# Altium schematic sheet Sheet1.SchDoc
size A2
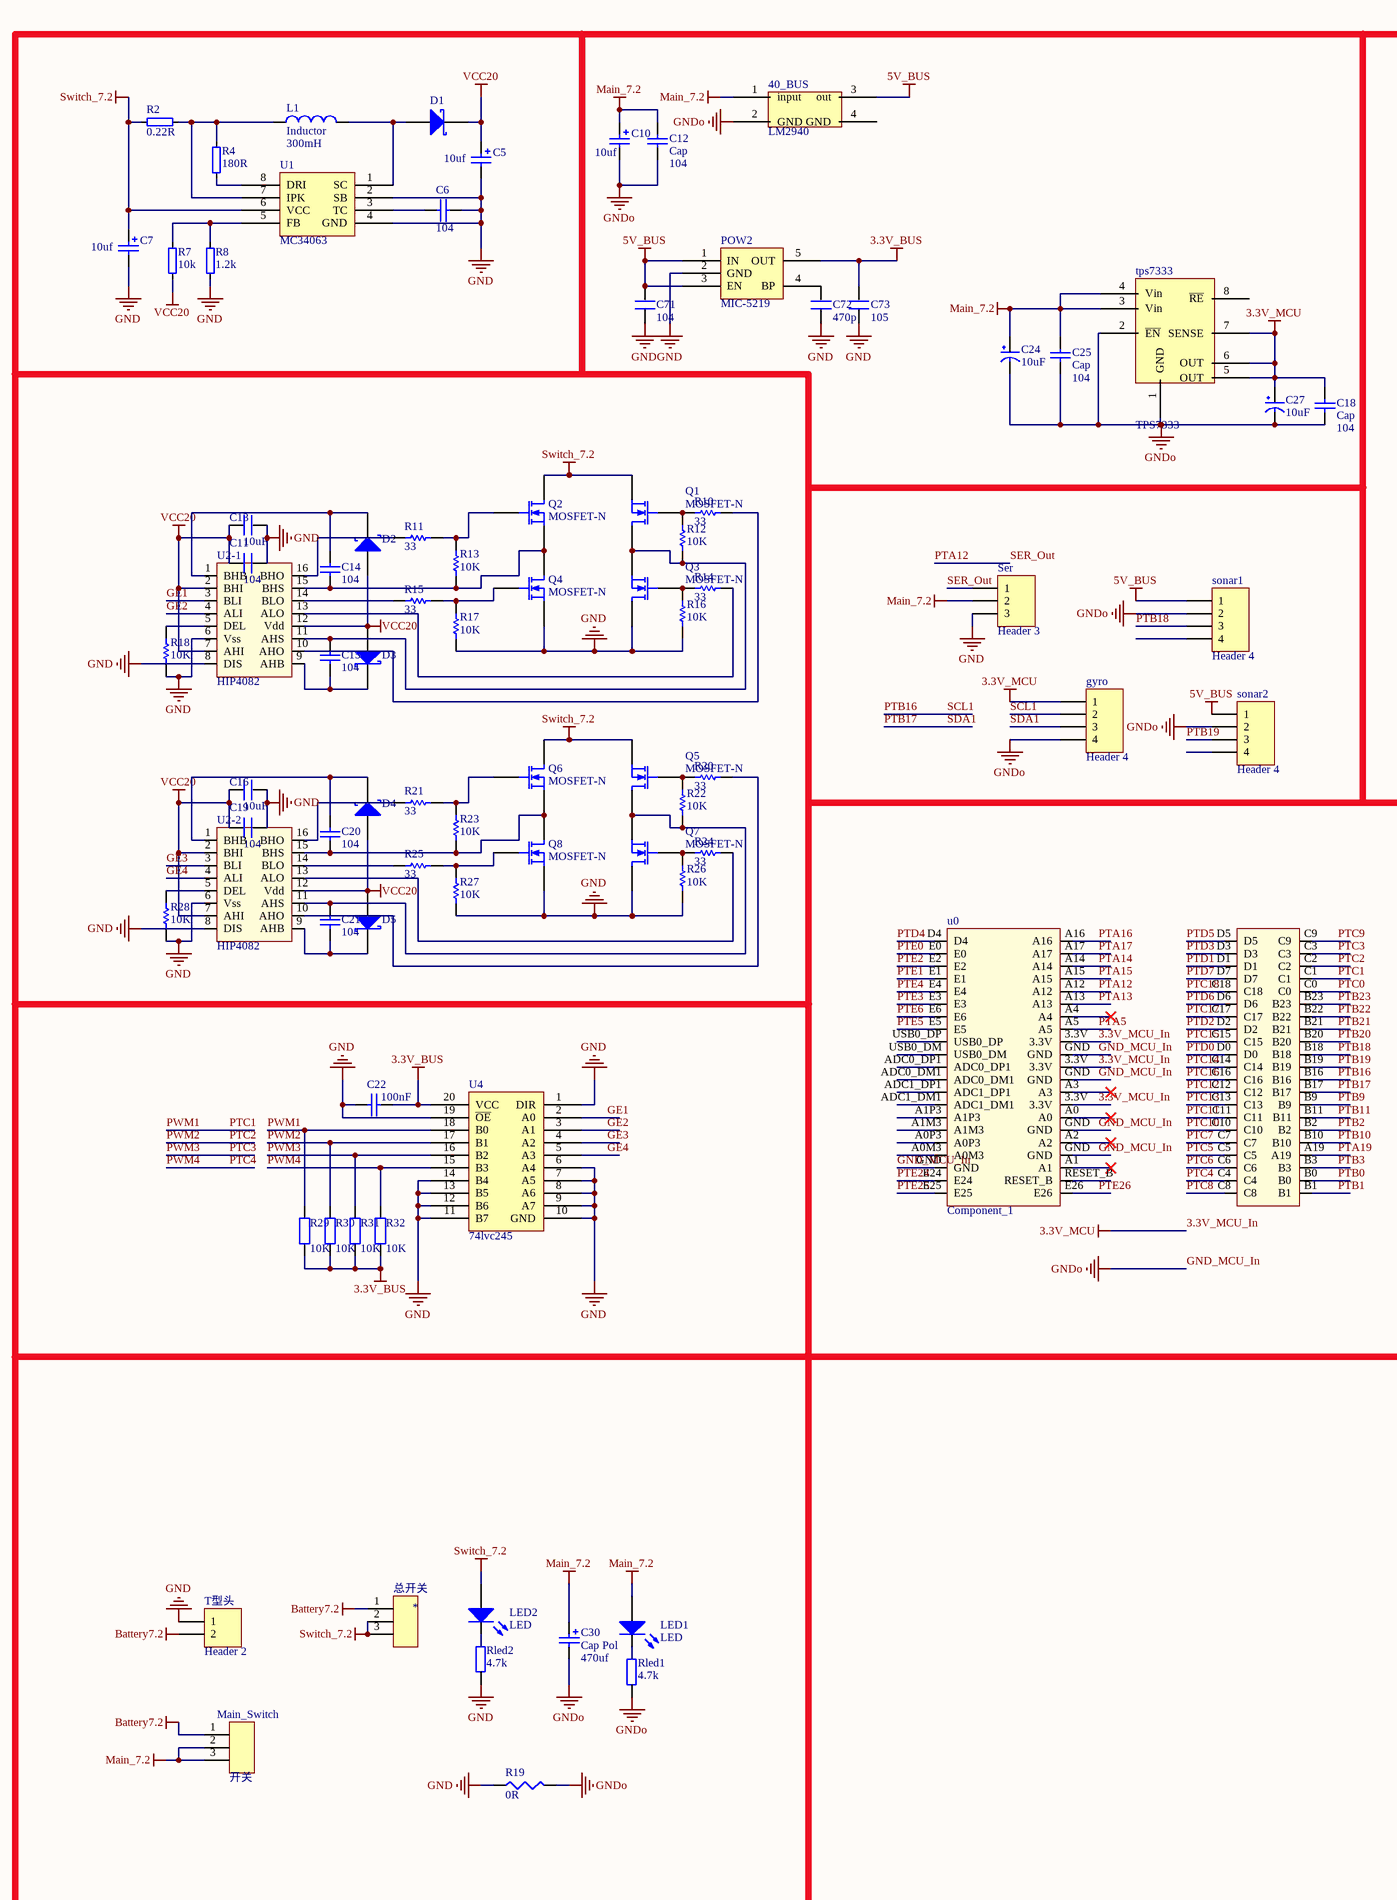
[diagram p0: Sheet1.SchDoc, left]
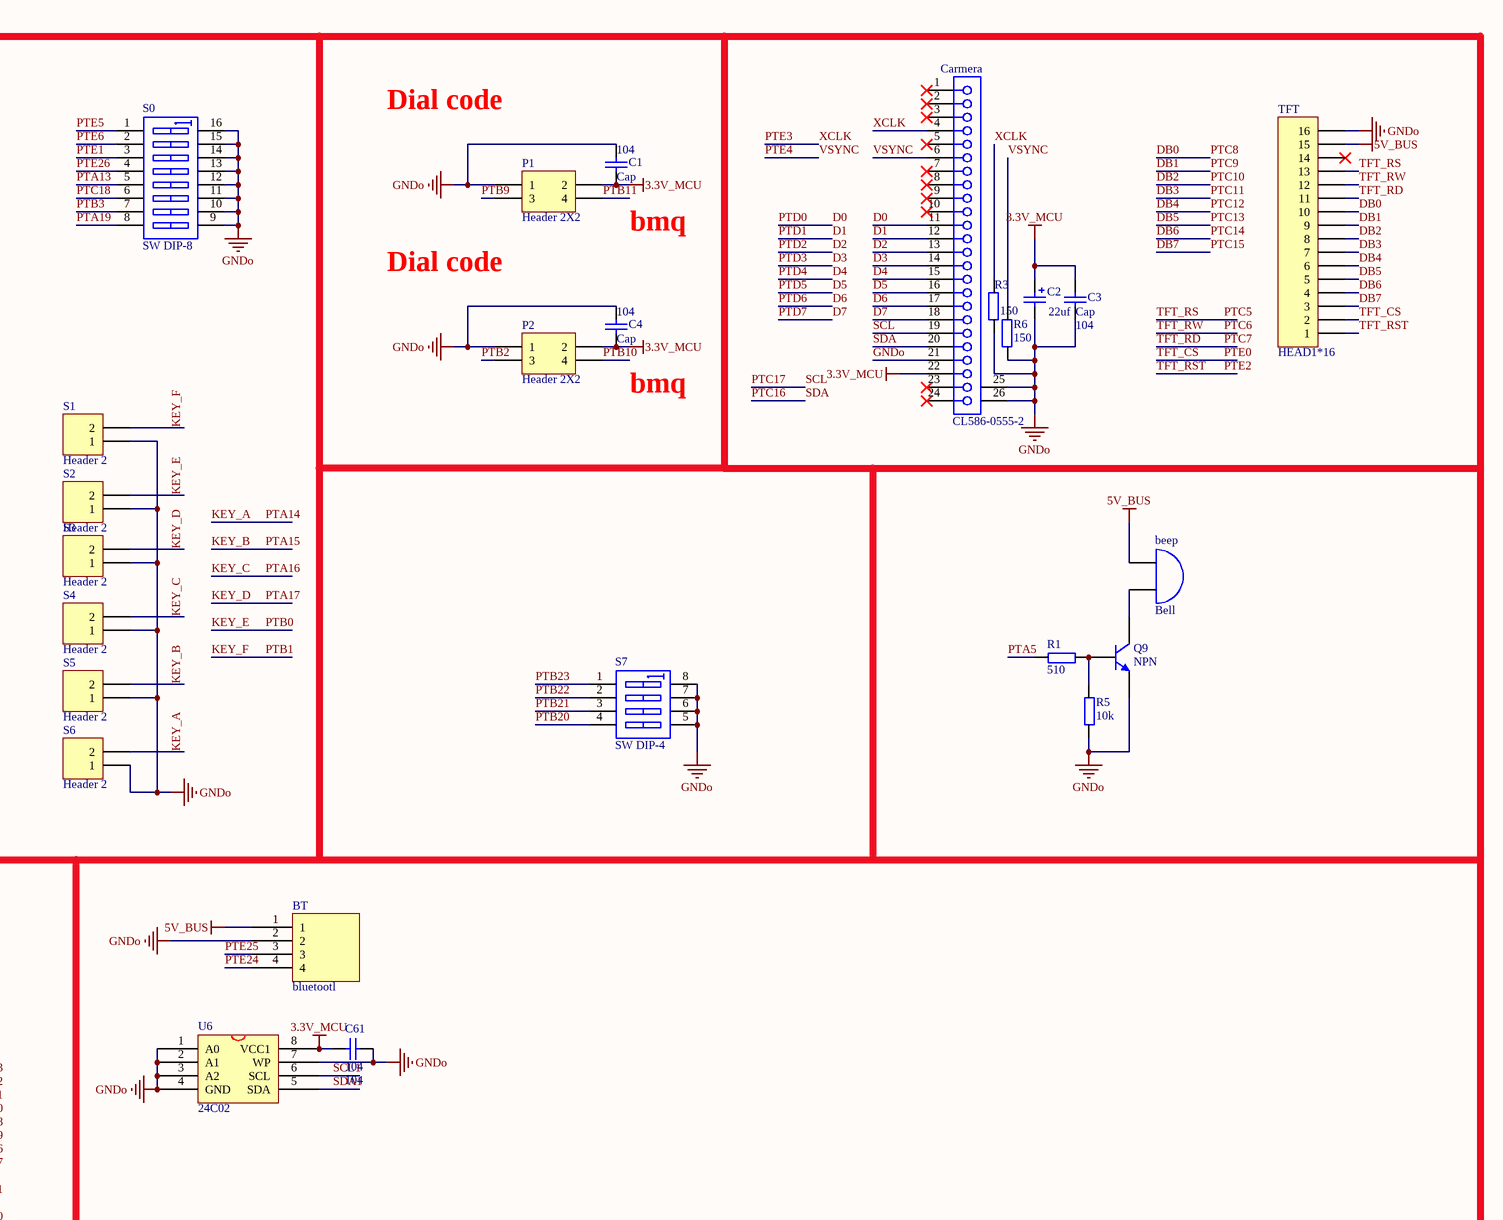
[diagram p1: Sheet1.SchDoc, right]

## Parts
40_BUS  LM2940  [TO-263-3]
beep  Bell  [bell]
BT  bluetootl  [HDR1X4]
C1  Cap  value 104  [0805-0C]
C2  value 22uf  [3216-A-TA]
C3  Cap  value 104  [0805-0C]
C4  Cap  value 104  [0805-0C]
C5  value 10uf  [3216-A-TA]
C6  104  [0805-0C]
C7  value 10uf  [3216-A-TA]
C10  value 10uf  [3216-A-TA]
C11  104  [0805-0C]
C12  Cap  value 104  [0805-0C]
C13  10uF  [3216-A-TA]
C14  value 104  [0805-0C]  (hidden comment: Cap)
C15  value 104  [0805-0C]  (hidden comment: Cap)
C16  10uF  [3216-A-TA]
C18  Cap  value 104  [0805-0C]
C19  104  [0805-0C]
C20  value 104  [0805-0C]  (hidden comment: Cap)
C21  value 104  [0805-0C]  (hidden comment: Cap)
C22  100nF  [0603C]
C24  10uF  [3216-A-TA]
C25  Cap  value 104  [0805-0C]
C27  10uF  [3216-A-TA]
C30  Cap Pol  value 470uf  [C7343]
C61  104  [0603C]
C71  104  [0603P]
C72  470p  [0603P]
C73  105  [0603P]
Carmera  CL586-0555-2  [FH12A-24S-0.5SH]
D1  D Schottky  [DO-214]  (value not drawn)
D2  D Schottky  [DO-214]  (value not drawn)
D3  D Schottky  [DO-214]  (value not drawn)
D4  D Schottky  [DO-214]  (value not drawn)
D5  D Schottky  [DO-214]  (value not drawn)
gyro  Header 4  [HDR1X4]
L1  Inductor  value 300mH  [L7X7]
LED1  LED  [0805LED2]
LED2  LED  [0805LED2]
Main_Switch  开关  [乒乓开关5mm]
P1  Header 2X2  [HDR2X2]
P2  Header 2X2  [HDR2X2]
POW2  MIC-5219  [sot23-5]
Q1  MOSFET-N  [to252]
Q2  MOSFET-N  [to252]
Q3  MOSFET-N  [to252]
Q4  MOSFET-N  [to252]
Q5  MOSFET-N  [to252]
Q6  MOSFET-N  [to252]
Q7  MOSFET-N  [to252]
Q8  MOSFET-N  [to252]
Q9  NPN  [TO-226-AA]
R1  510  [0805-0R]
R2  0.22R  [0805-0R]
R3  150  [0805-0R]
R4  180R  [0805-0R]
R5  10k  [0805-0r]
R6  150  [0805-0R]
R7  10k  [0805-0R]
R8  1.2k  [0805-0R]
R10  value 33  [0805-0R]  (hidden comment: Res1)
R11  value 33  [0805-0R]  (hidden comment: Res1)
R12  value 10K  [0805-0R]  (hidden comment: Res1)
R13  value 10K  [0805-0R]  (hidden comment: Res1)
R14  value 33  [0805-0R]  (hidden comment: Res1)
R15  value 33  [0805-0R]  (hidden comment: Res1)
R16  value 10K  [0805-0R]  (hidden comment: Res1)
R17  value 10K  [0805-0R]  (hidden comment: Res1)
R18  value 10K  [0805-0R]  (hidden comment: Res1)
R19  value 0R  [0805-0R]  (hidden comment: Res)
R20  value 33  [0805-0R]  (hidden comment: Res1)
R21  value 33  [0805-0R]  (hidden comment: Res1)
R22  value 10K  [0805-0R]  (hidden comment: Res1)
R23  value 10K  [0805-0R]  (hidden comment: Res1)
R24  value 33  [0805-0R]  (hidden comment: Res1)
R25  value 33  [0805-0R]  (hidden comment: Res1)
R26  value 10K  [0805-0R]  (hidden comment: Res1)
R27  value 10K  [0805-0R]  (hidden comment: Res1)
R28  value 10K  [0805-0R]  (hidden comment: Res1)
R29  value 10K  [0603R]  (hidden comment: Res2)
R30  value 10K  [0603R]  (hidden comment: Res2)
R31  value 10K  [0603R]  (hidden comment: Res2)
R32  value 10K  [0603R]  (hidden comment: Res2)
Rled1  4.7k  [0805-0R]
Rled2  4.7k  [0805-0R]
S0  SW DIP-8  [SW-DIP8]
S1  Header 2  [SW-SMD1]
S2  Header 2  [SW-SMD1]
S3  Header 2  [SW-SMD1]
S4  Header 2  [SW-SMD1]
S5  Header 2  [SW-SMD1]
S6  Header 2  [SW-SMD1]
S7  SW DIP-4  [DIP-8]
Ser  Header 3  [HDR1X3]
sonar1  Header 4  [HDR1X4]
sonar2  Header 4  [HDR1X4]
TFT  HEAD1*16  [HDR1X16]
tps7333  TPS7333  [sop8]
T型头  Header 2  [T HEAD]
u0  Component_1  [K60_100]
U1  MC34063  [sop8]
U2-1  HIP4082  [SOP-16]
U2-2  HIP4082  [SOP-16]
U4  74lvc245  [TSSOP20]
U6  24C02  [SOP8]
总开关  *  [乒乓开关5mm]

## Nets
3.3V_BUS: C22.2 C73.2 POW2.5(OUT) R29.1 R30.1 R31.1 R32.1 U4.20(VCC)
3.3V_MCU_In: C1.1 C2.1 C3.2 C4.1 C18.2 C27.1(VCC) C61.2 Carmera.22 gyro.1 P1.2 P2.2 tps7333.5(OUT) tps7333.6(OUT) tps7333.7(SENSE) u0.3.3V U6.8(VCC1)  [also labelled 3.3V_MCU]
5V_BUS: 40_BUS.3(out) beep.1(A) BT.1 C71.2 POW2.1(IN) POW2.3(EN) sonar1.1 sonar2.1 TFT.15
Battery7.2: Main_Switch.1 T型头.2 总开关.1
GND: C5.2 C6.2 C7.2 C11.1 C13.1 C16.1 C19.1 C22.1 C71.1 C72.1 C73.1 POW2.2(GND) Q3.1(D) Q4.3(S) Q7.1(D) Q8.3(S) R8.1 R16.1 R17.1 R18.2 R19.1 R26.1 R27.1 R28.2 Rled2.2 Ser.3 T型头.1 U1.2(SB) U1.4(GND) U2-1.6(Vss) U2-1.8(DIS) U2-2.6(Vss) U2-2.8(DIS) U4.1(DIR) U4.6(A4) U4.7(A5) U4.8(A6) U4.9(A7) U4.10(GND) U4.11(B7) U4.12(B6) U4.13(B5) U4.14(B4) U4.19(~{OE})
GND_MCU_In: 40_BUS.2(GND) BT.2 C1.2 C2.2 C3.1 C4.2 C10.2 C12.1 C18.1 C24.2(GND) C25.1 C27.2(GND) C30.2 C61.1 Carmera.21 Carmera.25(MH1) Carmera.26(MH2) gyro.4 P1.1 P2.1 Q9.3(E) R3.2 R5.1 R6.2 R19.2 Rled1.2 S0.9(B8) S0.10(B7) S0.11(B6) S0.12(B5) S0.13(B4) S0.14(B3) S0.15(B2) S0.16(B1) S1.1 S2.1 S3.1 S4.1 S5.1 S6.1 S7.5(B4) S7.6(B3) S7.7(B2) S7.8(B1) sonar1.2 sonar2.2 TFT.16 tps7333.1(GND) tps7333.2(~{EN}) u0.GND U6.1(A0) U6.2(A1) U6.3(A2) U6.4(GND) U6.7(WP)  [also labelled GNDo]
Main_7.2: 40_BUS.1(input) C10.1 C12.2 C24.1(VCC) C25.2 C30.1 LED1.1(A) Main_Switch.2 Main_Switch.3 Ser.2 tps7333.3(Vin) tps7333.4(Vin)
Switch_7.2: C7.1 LED2.1(A) Q1.3(S) Q2.1(D) Q5.3(S) Q6.1(D) R2.1 U1.6(VCC) 总开关.2 总开关.3
VCC20: C5.1 C11.2 C13.2 C16.2 C19.2 D1.2(K) D2.1(A) D3.1(A) D4.1(A) D5.1(A) R7.1 U2-1.2(BHI) U2-1.7(AHI) U2-1.12(Vdd) U2-2.2(BHI) U2-2.7(AHI) U2-2.12(Vdd)
D0: Carmera.11 u0.D0  [also labelled PTD0]
D1: Carmera.12 u0.D1  [also labelled PTD1]
D2: Carmera.13 u0.D2  [also labelled PTD2]
D3: Carmera.14 u0.D3  [also labelled PTD3]
D4: Carmera.15 u0.D4  [also labelled PTD4]
D5: Carmera.16 u0.D5  [also labelled PTD5]
D6: Carmera.17 u0.D6  [also labelled PTD6]
D7: Carmera.18 u0.D7  [also labelled PTD7]
DB0: TFT.10 u0.C8  [also labelled PTC8]
DB1: TFT.9 u0.C9  [also labelled PTC9]
DB2: TFT.8 u0.C10  [also labelled PTC10]
DB3: TFT.7 u0.C11  [also labelled PTC11]
DB4: TFT.6 u0.C12  [also labelled PTC12]
DB5: TFT.5 u0.C13  [also labelled PTC13]
DB6: TFT.4 u0.C14  [also labelled PTC14]
DB7: TFT.3 u0.C15  [also labelled PTC15]
GE1: U2-1.3(BLI) U4.2(A0)
GE2: U2-1.4(ALI) U4.3(A1)
GE3: U2-2.3(BLI) U4.4(A2)
GE4: U2-2.4(ALI) U4.5(A3)
KEY_A: S6.2 u0.A14  [also labelled PTA14]
KEY_B: S5.2 u0.A15  [also labelled PTA15]
KEY_C: S4.2 u0.A16  [also labelled PTA16]
KEY_D: S3.2 u0.A17  [also labelled PTA17]
KEY_E: S2.2 u0.B0  [also labelled PTB0]
KEY_F: S1.2 u0.B1  [also labelled PTB1]
PTA5: R1.1 u0.A5
PTA12: Ser.1 u0.A12  [also labelled SER_Out]
PTA13: S0.5(A5) u0.A13
PTA19: S0.8(A8) u0.A19
PTB2: P2.3 u0.B2
PTB3: S0.7(A7) u0.B3
PTB9: P1.3 u0.B9
PTB10: P2.4 u0.B10
PTB11: P1.4 u0.B11
PTB16: gyro.2 u0.B16 U6.6(SCL)  [also labelled SCL1]
PTB17: gyro.3 u0.B17 U6.5(SDA)  [also labelled SDA1]
PTB18: sonar1.3 u0.B18
PTB19: sonar2.3 u0.B19
PTB20: S7.4(A4) u0.B20
PTB21: S7.3(A3) u0.B21
PTB22: S7.2(A2) u0.B22
PTB23: S7.1(A1) u0.B23
PTC0: u0.C0
PTC1: R29.2 u0.C1 U4.18(B0)  [also labelled PWM1]
PTC2: R30.2 u0.C2 U4.17(B1)  [also labelled PWM2]
PTC3: R31.2 u0.C3 U4.16(B2)  [also labelled PWM3]
PTC4: R32.2 u0.C4 U4.15(B3)  [also labelled PWM4]
PTC5: TFT.13 u0.C5  [also labelled TFT_RS]
PTC6: TFT.12 u0.C6  [also labelled TFT_RW]
PTC7: TFT.11 u0.C7  [also labelled TFT_RD]
PTC16: Carmera.20 u0.C16  [also labelled SDA]
PTC17: Carmera.19 u0.C17  [also labelled SCL]
PTC18: S0.6(A6) u0.C18
PTE0: TFT.2 u0.E0  [also labelled TFT_CS]
PTE1: S0.3(A3) u0.E1
PTE2: TFT.1 u0.E2  [also labelled TFT_RST]
PTE3: Carmera.4 R3.1 u0.E3  [also labelled XCLK]
PTE4: Carmera.6 R6.1 u0.E4  [also labelled VSYNC]
PTE5: S0.1(A1) u0.E5
PTE6: S0.2(A2) u0.E6
PTE24: BT.4 u0.E24
PTE25: BT.3 u0.E25
PTE26: S0.4(A4) u0.E26
Netbeep_2: beep.2(B) Q9.1(C)
NetC6_1: C6.1 U1.3(TC)
NetC14_1: C14.1 Q2.3(S) Q4.1(D) R13.1 U2-1.15(BHS)
NetC14_2: C14.2 D2.2(K) U2-1.1(BHB)
NetC15_1: C15.1 Q1.1(D) Q3.3(S) R12.1 U2-1.11(AHS)
NetC15_2: C15.2 D3.2(K) U2-1.9(AHB)
NetC20_1: C20.1 Q6.3(S) Q8.1(D) R23.1 U2-2.15(BHS)
NetC20_2: C20.2 D4.2(K) U2-2.1(BHB)
NetC21_1: C21.1 Q5.1(D) Q7.3(S) R22.1 U2-2.11(AHS)
NetC21_2: C21.2 D5.2(K) U2-2.9(AHB)
NetC72_2: C72.2 POW2.4(BP)
NetD1_1: D1.1(A) L1.2 U1.1(SC)
NetL1_1: L1.1 R2.2 R4.2 U1.7(IPK)
NetLED1_2: LED1.2(K) Rled1.1
NetLED2_2: LED2.2(K) Rled2.1
NetQ1_2: Q1.2(G) R10.1 R12.2
NetQ2_2: Q2.2(G) R11.2 R13.2
NetQ3_2: Q3.2(G) R14.1 R16.2
NetQ4_2: Q4.2(G) R15.2 R17.2
NetQ5_2: Q5.2(G) R20.1 R22.2
NetQ6_2: Q6.2(G) R21.2 R23.2
NetQ7_2: Q7.2(G) R24.1 R26.2
NetQ8_2: Q8.2(G) R25.2 R27.2
NetQ9_2: Q9.2(B) R1.2 R5.2
NetR4_1: R4.1 U1.8(DRI)
NetR7_2: R7.2 R8.2 U1.5(FB)
NetR10_2: R10.2 U2-1.10(AHO)
NetR11_1: R11.1 U2-1.16(BHO)
NetR14_2: R14.2 U2-1.13(ALO)
NetR15_1: R15.1 U2-1.14(BLO)
NetR18_1: R18.1 U2-1.5(DEL)
NetR20_2: R20.2 U2-2.10(AHO)
NetR21_1: R21.1 U2-2.16(BHO)
NetR24_2: R24.2 U2-2.13(ALO)
NetR25_1: R25.1 U2-2.14(BLO)
NetR28_1: R28.1 U2-2.5(DEL)

Not connected (* = marked no-connect by the designer): 40_BUS 4(GND); Carmera 1* 2* 3* 5* 7* 8* 9* 10* 23* 24*; sonar1 4; sonar2 4; TFT 14*; tps7333 8(~{RE}); u0 A0* A0M3 A0P3 A1* A1M3 A1P3 A2* A3* A4* ADC0_DM1 ADC0_DP1 ADC1_DM1 ADC1_DP1 RESET_B USB0_DM USB0_DP

## Notes on the sheet
- Dial code
- bmq

## Library data of the parts
beep = Bell: Electrical Bell; Published: 24-Mar-1999; LatestRevisionDate: 17-Jul-2002; LatestRevisionNote: Re-released for DXP Platform.; PackageReference: PIN2; Publisher: Altium Limited
BT = USB: 4 Pin Header
C1 C3 C4 C12 C14 C15 C18 C20-C22 C25 C61 = Cap: Capacitor
  C1 C3 C4 C12 C18 C25: Published: 8-Jun-2000; LatestRevisionDate: 17-Jul-2002; LatestRevisionNote: Re-released for DXP Platform.; PackageReference: RAD-0.3; Publisher: Altium Limited; PackageDescription: Radial Cap, Thru-Hole; 2 Leads; 0.3 in Pin Spacing
  C14 C15 C20 C21: Published: 8-Jun-2000; LatestRevisionDate: 17-Jul-2002; LatestRevisionNote: Re-released for DXP Platform.; PackageReference: RAD-0.3; Publisher: Altium Limited
  C61: Published: 8-Jun-2000; LatestRevisionDate: 17-Jul-2002; LatestRevisionNote: Re-released for DXP Platform.; PackageReference: RAD-0.3; Publisher: Altium Limited; PackageDescription: Radial Cap, Thru-Hole; 2 Leads; 0.3 in Pin Spacing; Value: 104
C2 C5 C7 C10 C30 = Cap: Polarized Capacitor (Radial); Published: 8-Jun-2000; LatestRevisionDate: 17-Jul-2002; LatestRevisionNote: Re-released for DXP Platform.; PackageReference: RB7.6-15; Publisher: Altium Limited; PackageDescription: Polarized Capacitor (Radial); 2 Leads
C6 = 普通电容: Capacitor
C11 C13 C16 C19 C71-C73 = C
C24 C27 = C: 有极性电容
Carmera = CL586-0555-2: FH12 Series, "Flip-Lock" SMT/ZIF FFC/FPC Connector - 0.5mm Spaced Top Contact; Positions: 24; ContactMaterial: Phosphor Bronze; Current: 0.4A; PCB_Layout: Complies with manufacturer's recommendation.; Note: Pad dimensions follow nominal values, Suitable for Wave Soldering, Adjust for Re-flow.; Published: 17-Jul-2002; DatasheetVersion: 13-Nov-2000; PackageVersion: 13-Nov-2000; PackageReference: FH12A-24S-0.5SH; Publisher: Altium Limited; ComponentLink1Description: Manufacturer Link; ComponentLink1URL: http://www.hiroseusa.com/; ComponentLink2Description: Datasheet; ComponentLink2URL: http://www.hirose.co.jp/cataloge_hp/e58605370.pdf
D1-D5 = D Schottky: Schottky Diode; Published: 8-Jun-2000; LatestRevisionDate: 17-Jul-2002; LatestRevisionNote: Re-released for DXP Platform.; PackageReference: SMB; Publisher: Altium Limited; Code_JEDEC: DO-214-AA
gyro sonar1 sonar2 = Header 4: Header, 4-Pin; LatestRevisionDate: 17-Jul-2002; LatestRevisionNote: Re-released for DXP Platform.; Publisher: Altium Limited
L1 = Inductor: Code_IEC: 1005; Published: 8-Jun-2000; LatestRevisionDate: 17-Jul-2002; LatestRevisionNote: Re-released for DXP Platform.; PackageReference: 0402-A; Publisher: Altium Limited; Code_JEITA: 0402
LED1 LED2 = LED: 发光二极管
Main_Switch 总开关 = 乒乓开关
P1 P2 = Header 2X2: Header, 2-Pin, Dual row; LatestRevisionDate: 17-Jul-2002; LatestRevisionNote: Re-released for DXP Platform.; Publisher: Altium Limited
Q1 Q3 Q5 Q7 = MOSFET-N: N-Channel MOSFET; pin to pad: 1>3 2>1 3>2; Published: 8-Jun-2000; LatestRevisionDate: 17-Jul-2002; LatestRevisionNote: Re-released for DXP Platform.; PackageVersion: 1995/1996; PackageReference: E3; Publisher: Altium Limited; PackageDescription: TO, Flat Index; 3 In-Line, Axial Leads; Body Dia. 4.6mm; Lead Dia. 0.5 mm (max)
Q2 Q4 Q6 Q8 = MOSFET-N: N-Channel MOSFET; pin to pad: 1>2 2>1; Published: 8-Jun-2000; LatestRevisionDate: 17-Jul-2002; LatestRevisionNote: Re-released for DXP Platform.; PackageVersion: 1995/1996; PackageReference: E3; Publisher: Altium Limited; PackageDescription: TO, Flat Index; 3 In-Line, Axial Leads; Body Dia. 4.6mm; Lead Dia. 0.5 mm (max)
Q9 = NPN: NPN Bipolar Transistor; Published: 8-Jun-2000; LatestRevisionDate: 17-Jul-2002; LatestRevisionNote: Re-released for DXP Platform.; PackageReference: TO-226-AA; Publisher: Altium Limited; PackageDescription: TO, Flat Index; 3 In-Line, Axial Leads; Body Dia. 4.8mm; Leads 0.55 x 0.51 mm (max); Code_JEDEC: TO-226-AA
R1 R3 R5 R6 Rled1 Rled2 = Res
R2 R4 R7 R8 = RES
R10-R18 R20-R28 = Res1: Resistor; Published: 8-Jun-2000; LatestRevisionDate: 17-Jul-2002; LatestRevisionNote: Re-released for DXP Platform.; PackageReference: AXIAL-0.3; Publisher: Altium Limited
R19 = Res: Resistor; Published: 8-Jun-2000; LatestRevisionDate: 29-May-2009; LatestRevisionNote: IPC-7351 Footprint Added.; PackageReference: J1-0603; Publisher: Altium Limited; PackageDescription: Chip Resistor
R29-R32 = Res2: Resistor; Published: 8-Jun-2000; LatestRevisionDate: 17-Jul-2002; LatestRevisionNote: Re-released for DXP Platform.; PackageReference: AXIAL-0.4; Publisher: Altium Limited; PackageDescription: Axial Device, Thru-Hole; 2 Leads; 0.4 in Pin Spacing
S0 = SW DIP-8: DIP Switch
S1-S6 T型头 = Header 2: Header, 2-Pin; LatestRevisionDate: 17-Jul-2002; LatestRevisionNote: Re-released for DXP Platform.; Publisher: Altium Limited
S7 = SW DIP-4: DIP Switch
Ser = Header 3: Header, 3-Pin; LatestRevisionDate: 17-Jul-2002; LatestRevisionNote: Re-released for DXP Platform.; Publisher: Altium Limited
TFT = Header 16: Header, 16-Pin; LatestRevisionDate: 17-Jul-2002; LatestRevisionNote: Re-released for DXP Platform.; Publisher: Altium Limited
U1 U2-1 U2-2 = Component_1
U6 = 24C256